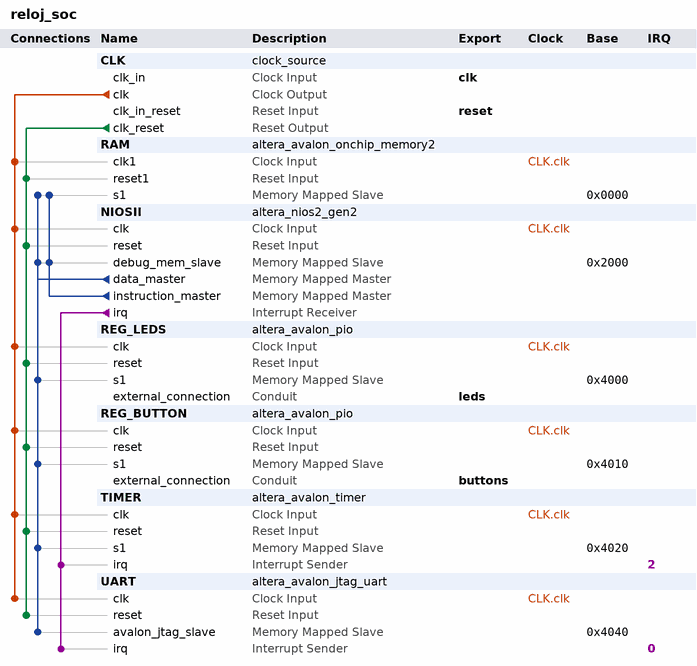
[diagram p0: system contents]
# Platform Designer (Qsys) system reloj_soc, Cyclone V 5CSXFC6D6F31C6
# Parameters at their usual value, and those the tool derives, are not listed.
package require -exact qsys 18.1
create_system reloj_soc
set_project_property DEVICE_FAMILY {Cyclone V}
set_project_property DEVICE 5CSXFC6D6F31C6

add_instance CLK clock_source 18.1
set_instance_parameter_value CLK clockFrequency 50000000

add_instance RAM altera_avalon_onchip_memory2 18.1
set_instance_parameter_value RAM dataWidth 32
set_instance_parameter_value RAM dualPort false
set_instance_parameter_value RAM initMemContent true
set_instance_parameter_value RAM initializationFileName onchip_mem.hex
set_instance_parameter_value RAM memorySize 8192

add_instance NIOSII altera_nios2_gen2 18.1
set_instance_parameter_value NIOSII dcache_size 2048
set_instance_parameter_value NIOSII exceptionSlave RAM.s1
set_instance_parameter_value NIOSII icache_size 4096
set_instance_parameter_value NIOSII impl Tiny
set_instance_parameter_value NIOSII resetSlave RAM.s1

add_instance REG_LEDS altera_avalon_pio 18.1
set_instance_parameter_value REG_LEDS direction Output
set_instance_parameter_value REG_LEDS width 32

add_instance REG_BUTTON altera_avalon_pio 18.1
set_instance_parameter_value REG_BUTTON direction Input
set_instance_parameter_value REG_BUTTON width 32

add_instance TIMER altera_avalon_timer 18.1
set_instance_parameter_value TIMER fixedPeriod true
set_instance_parameter_value TIMER period 1
set_instance_parameter_value TIMER periodUnits MSEC

add_instance UART altera_avalon_jtag_uart 18.1
set_instance_parameter_value UART simInteractiveOptions NO_INTERACTIVE_WINDOWS

# connections
add_connection CLK.clk NIOSII.clk clock
add_connection CLK.clk RAM.clk1 clock
add_connection CLK.clk REG_BUTTON.clk clock
add_connection CLK.clk REG_LEDS.clk clock
add_connection CLK.clk TIMER.clk clock
add_connection CLK.clk UART.clk clock
add_connection CLK.clk_reset NIOSII.reset reset
add_connection CLK.clk_reset RAM.reset1 reset
add_connection CLK.clk_reset REG_BUTTON.reset reset
add_connection CLK.clk_reset REG_LEDS.reset reset
add_connection CLK.clk_reset TIMER.reset reset
add_connection CLK.clk_reset UART.reset reset
add_connection NIOSII.data_master NIOSII.debug_mem_slave avalon
set_connection_parameter_value NIOSII.data_master/NIOSII.debug_mem_slave baseAddress 0x2000
add_connection NIOSII.data_master RAM.s1 avalon
set_connection_parameter_value NIOSII.data_master/RAM.s1 baseAddress 0x0000
add_connection NIOSII.data_master REG_BUTTON.s1 avalon
set_connection_parameter_value NIOSII.data_master/REG_BUTTON.s1 baseAddress 0x4010
add_connection NIOSII.data_master REG_LEDS.s1 avalon
set_connection_parameter_value NIOSII.data_master/REG_LEDS.s1 baseAddress 0x4000
add_connection NIOSII.data_master TIMER.s1 avalon
set_connection_parameter_value NIOSII.data_master/TIMER.s1 baseAddress 0x4020
add_connection NIOSII.data_master UART.avalon_jtag_slave avalon
set_connection_parameter_value NIOSII.data_master/UART.avalon_jtag_slave baseAddress 0x4040
add_connection NIOSII.instruction_master NIOSII.debug_mem_slave avalon
set_connection_parameter_value NIOSII.instruction_master/NIOSII.debug_mem_slave baseAddress 0x2000
add_connection NIOSII.instruction_master RAM.s1 avalon
set_connection_parameter_value NIOSII.instruction_master/RAM.s1 baseAddress 0x0000
add_connection NIOSII.irq TIMER.irq interrupt
set_connection_parameter_value NIOSII.irq/TIMER.irq irqNumber 2
add_connection NIOSII.irq UART.irq interrupt
set_connection_parameter_value NIOSII.irq/UART.irq irqNumber 0

# exported interfaces
add_interface buttons conduit end
set_interface_property buttons EXPORT_OF REG_BUTTON.external_connection
add_interface clk clock sink
set_interface_property clk EXPORT_OF CLK.clk_in
add_interface leds conduit end
set_interface_property leds EXPORT_OF REG_LEDS.external_connection
add_interface reset reset sink
set_interface_property reset EXPORT_OF CLK.clk_in_reset

set_interconnect_requirement {$system} qsys_mm.clockCrossingAdapter HANDSHAKE
set_interconnect_requirement {$system} qsys_mm.enableEccProtection FALSE
set_interconnect_requirement {$system} qsys_mm.insertDefaultSlave FALSE
set_interconnect_requirement {$system} qsys_mm.maxAdditionalLatency 1

save_system reloj_soc.qsys
